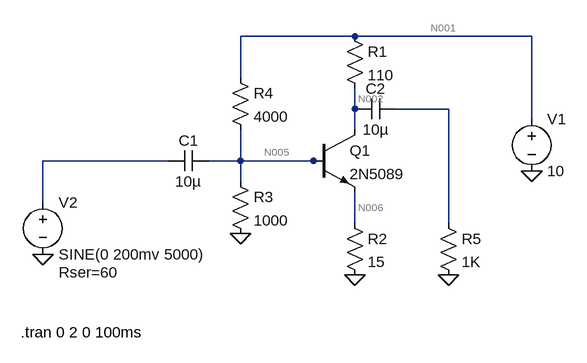
[diagram p0: schematic Class A.asc]
Class A.asc, the LTspice schematic file:
Version 4
SHEET 1 880 680
WIRE 224 -80 48 -80
WIRE 496 -80 224 -80
WIRE 48 -16 48 -80
WIRE 224 32 224 0
WIRE 368 32 288 32
WIRE 496 48 496 -80
WIRE 224 64 224 32
WIRE -64 112 -256 112
WIRE 48 112 48 64
WIRE 48 112 0 112
WIRE 160 112 48 112
WIRE 176 112 160 112
WIRE 48 144 48 112
WIRE -256 176 -256 112
WIRE 224 208 224 160
WIRE 368 208 368 32
FLAG 496 128 0
FLAG -256 256 0
FLAG 48 224 0
FLAG 224 288 0
FLAG 368 288 0
SYMBOL npn 160 64 R0
SYMATTR InstName Q1
SYMATTR Value 2N5089
SYMBOL res 208 -96 R0
SYMATTR InstName R1
SYMATTR Value 110
SYMBOL voltage 496 32 R0
WINDOW 123 0 0 Left 2
WINDOW 39 0 0 Left 2
SYMATTR InstName V1
SYMATTR Value 10
SYMBOL res 32 -32 R0
SYMATTR InstName R4
SYMATTR Value 4000
SYMBOL res 32 128 R0
SYMATTR InstName R3
SYMATTR Value 1000
SYMBOL res 208 192 R0
SYMATTR InstName R2
SYMATTR Value 15
SYMBOL cap 0 96 R90
WINDOW 0 0 32 VBottom 2
WINDOW 3 32 32 VTop 2
SYMATTR InstName C1
SYMATTR Value 10µ
SYMBOL voltage -256 160 R0
WINDOW 123 0 0 Left 2
WINDOW 39 24 124 Left 2
SYMATTR SpiceLine Rser=60
SYMATTR InstName V2
SYMATTR Value SINE(0 200mv 5000)
SYMBOL cap 288 16 R90
WINDOW 0 0 32 VBottom 2
WINDOW 3 32 32 VTop 2
SYMATTR InstName C2
SYMATTR Value 10µ
SYMBOL res 352 192 R0
SYMATTR InstName R5
SYMATTR Value 1K
TEXT -290 376 Left 2 !.tran 0 2 0 100ms

The netlist it stands for:
* Class A.asc
Q1 N002 N005 N006 0 2N5089
R1 N001 N002 110
V1 N001 0 10
R4 N001 N005 4000
R3 N005 0 1000
R2 N006 0 15
C1 N005 N004 10µ
V2 N004 0 SINE(0 200mv 5000) Rser=60
C2 N003 N002 10µ
R5 N003 0 1K
.model NPN NPN
.model PNP PNP
.lib standard.bjt
.tran 0 2 0 100ms
.backanno
.end

* Results of the author's LTspice run, read from the files saved beside the schematic
* Operating Point, zero values left out:
*   V(n002) = 2.883 V
*   V(n005) = 1.795 V
*   V(n006) = 974.3 mV
*   V(n001) = 10 V
*   Ic(Q1) = 64.7 mA
*   Ib(Q1) = 255.8 µA
*   Ie(Q1) = -64.95 mA
*   I(R2) = 64.95 mA
*   I(R3) = 1.795 mA
*   I(R4) = 2.051 mA
*   I(R1) = 64.7 mA
*   I(V1) = -66.75 mA